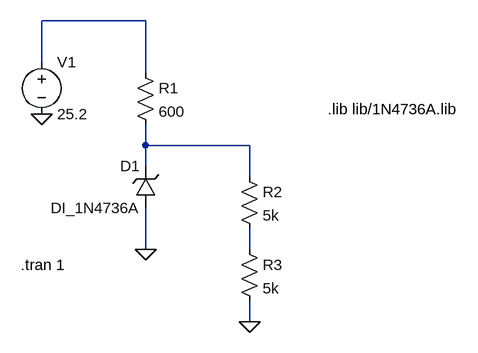
[diagram p0: schematic teste_zener.asc]
teste_zener.asc, the LTspice schematic file:
Version 4.1
SHEET 1 880 680
WIRE 16 48 -144 48
WIRE -144 112 -144 48
WIRE 16 128 16 48
WIRE 16 240 16 208
WIRE 176 240 16 240
WIRE 16 272 16 240
WIRE 176 288 176 240
WIRE 16 400 16 336
WIRE 176 400 176 368
WIRE 176 512 176 480
FLAG -144 192 0
FLAG 16 400 0
FLAG 176 512 0
SYMBOL voltage -144 96 R0
WINDOW 123 0 0 Left 0
WINDOW 39 0 0 Left 0
SYMATTR InstName V1
SYMATTR Value 25.2
SYMBOL res 0 112 R0
SYMATTR InstName R1
SYMATTR Value 600
SYMBOL zener 32 336 R180
WINDOW 0 24 64 Left 2
WINDOW 3 24 0 Left 2
SYMATTR InstName D1
SYMATTR Value DI_1N4736A
SYMATTR Prefix X
SYMBOL res 160 272 R0
SYMATTR InstName R2
SYMATTR Value 5k
SYMBOL res 160 384 R0
SYMATTR InstName R3
SYMATTR Value 5k
TEXT 296 184 Left 2 !.lib lib/1N4736A.lib
TEXT -176 424 Left 2 !.tran 1

The netlist it stands for:
* teste_zener.asc
V1 N001 0 25.2
R1 N001 N002 600
X§D1 0 N002 DI_1N4736A  ; pins + -
R2 N002 N003 5k
R3 N003 0 5k
.lib lib/1N4736A.lib
.tran 1
.backanno
.end